# Altium schematic sheet DSO_ADC.SchDoc: Schematic_Name
size A4; CompanyName: University of Melbourne; Engineer: Yijie Tao; DocumentNumber: 1; Revision: 0.1; SheetNumber: 1; SheetTotal: 1; Title_Project: DSO; StudentNo: Student No. 755391
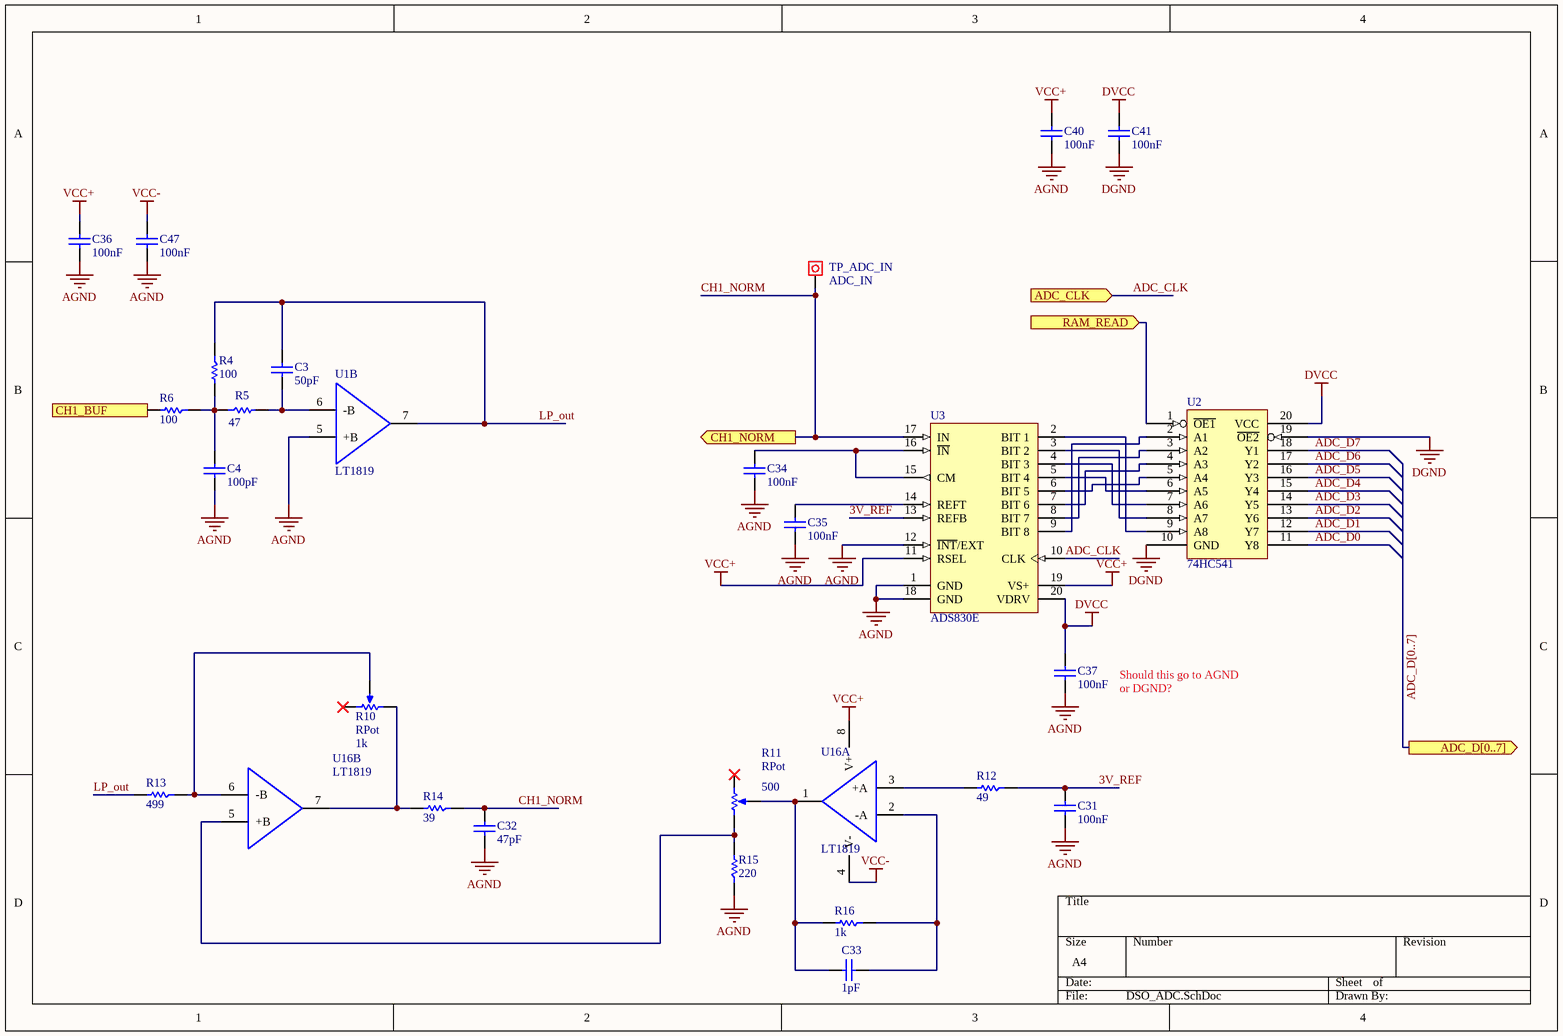
[diagram p0: DSO_ADC.SchDoc]

## Parts
C3  50pF  [0805C]
C4  100pF  [0805C]
C31  100nF  [0805C]
C32  47pF  [0805C]
C33  1pF  [0805C]
C34  100nF  [0805C]
C35  100nF  [0805C]
C36  100nF  [0805C]
C37  100nF  [0805C]
C40  100nF  [0805C]
C41  100nF  [0805C]
C47  100nF  [0805C]
R4  100  [0805]
R5  47  [0805]
R6  100  [0805]
R10  RPot  value 1k  [VR5]
R11  RPot  value 500  [VR5]
R12  49  [0805]
R13  499  [0805]
R14  39  [0805]
R15  220  [0805]
R16  1k  [0805]
TP_ADC_IN  value ADC_IN  [Testpoin]  (hidden comment: INPUT)
U1  LT1819  [SOIC-8]  (part B of 2)
U2  74HC541  [SOT163-1_N]
U3  ADS830E  [TI-DBQ20_L]
U16  LT1819  [SOIC-8]  (parts A,B of 2)

## Ports
ADC_CLK (in), ADC_D[0..7] (out), CH1_BUF (in), CH1_NORM (out), RAM_READ (in)

## Nets
AGND: C4.2 C31.2 C32.2 C34.2 C35.2 C36.2 C37.1 C40.2 C47.2 R15.1 U1.5(+B) U3.1(GND) U3.12(~{INT}/EXT) U3.18(GND)
DGND: C41.2 U2.10(GND) U2.19(~{OE2})
DVCC: C37.2 C41.1 U2.20(VCC) U3.20(VDRV)
VCC+: C36.1 C40.1 U3.11(RSEL) U3.19(VS+) U16.8(V+)
VCC-: C47.1 U16.4(V-)
3V_REF: C31.1 R12.1 U3.13(REFB)
ADC_CLK: U3.10(CLK) ; port ADC_CLK
ADC_D0: U2.11(Y8)
ADC_D1: U2.12(Y7)
ADC_D2: U2.13(Y6)
ADC_D3: U2.14(Y5)
ADC_D4: U2.15(Y4)
ADC_D5: U2.16(Y3)
ADC_D6: U2.17(Y2)
ADC_D7: U2.18(Y1)
CH1_BUF: R6.2 ; port CH1_BUF
CH1_NORM: C32.1 R14.1 TP_ADC_IN.1 U3.17(IN) ; port CH1_NORM
LP_out: C3.1 R4.1 R13.2 U1.7(OUTB)
RAM_READ: U2.1(~{OE1}) ; port RAM_READ
NetC3_2: C3.2 R5.2 U1.6(-B)
NetC4_1: C4.1 R4.2 R5.1 R6.1
NetC33_1: C33.1 R16.1 U16.2(-A)
NetC33_2: C33.2 R11.2(TAP) R16.2 U16.1(OUTA)
NetC34_1: C34.1 U3.15(CM) U3.16(~{IN})
NetC35_1: C35.1 U3.14(REFT)
NetR10_1: R10.1(TOP) R14.2 U16.7(OUTB)
NetR10_2: R10.2(TAP) R13.1 U16.6(-B)
NetR11_1: R11.1(TOP) R15.2 U16.5(+B)
NetR12_2: R12.2 U16.3(+A)
NetU2_2: U2.2(A1) U3.9(BIT_8)
NetU2_3: U2.3(A2) U3.8(BIT_7)
NetU2_4: U2.4(A3) U3.7(BIT_6)
NetU2_5: U2.5(A4) U3.6(BIT_5)
NetU2_6: U2.6(A5) U3.5(BIT_4)
NetU2_7: U2.7(A6) U3.4(BIT_3)
NetU2_8: U2.8(A7) U3.3(BIT_2)
NetU2_9: U2.9(A8) U3.2(BIT_1)

Not connected (* = marked no-connect by the designer): R10 3(BOT)*; R11 3(BOT)*

## Buses and harness runs
bus ADC_D[0..7] = port ADC_D[0..7]

## Notes on the sheet
- Should this go to AGND or DGND?

## Library data of the parts
C3 C4 C31-C37 C40 C41 C47 = C: Capacitor; Reviewed by: RM - 2018/08/05; Revision: July-2002: Re-released for DXP Platform.; Supplier 1: *; Supplier Part Number 1: *
  C3: Value: 50pF
  C4: Value: 100pF
  C31 C34-C37 C40 C41 C47: Value: 100nF
  C32: Value: 47pF
  C33: Value: 1pF
R4-R6 R12-R16 = R: Resistor; Reviewed by: RM - 2018/08/05; Supplier 1: *; Suppler Part Number 1: *
  R4 R6: Value: 100
  R5: Value: 47
  R12: Value: 49
  R13: Value: 499
  R14: Value: 39
  R15: Value: 220
  R16: Value: 1k
R10 R11 = RPot: Potentiometer; Sim Note: Enter the Resistance value and the set point into parameter fields.; Set Position: 0.5; Published: 8-Jun-2000; LatestRevisionDate: 17-Jul-2002; LatestRevisionNote: Re-released for DXP Platform.; PackageReference: VR5; Publisher: Altium Limited; PackageDescription: Variable Resistor, Thru-Hole; 3 Leads
TP_ADC_IN = Test Point: Pad
U1 U16 = LT1819: OpAmp High Frequency Dual; Reviewed by: RM - 2018/08/05; Supplier 1: Digi-Key; Supplier Part Number 1: LT1819CMS8#PBF-ND
U2 = 74HC541: (ADV) Octal Buffer, Line Driver; Reviewed by: RM - 2018/08/05; Supplier 1: Digi-Key; Supplier Part Number 1: 296-1202-1-ND
U3 = ADS830E: 8-Bit, 60 MSPS ADC Single-Ended / Differential Input, Internal / External Reference and Programmble Input Range, -40 to 85 degC, 20-pin SOP (DBQ20), Green (RoHS & no Sb/Br); Reviewed by: RM - 2018/08/05; ComponentLink2URL: http://www.ti.com/general/docs/lit/getliterature.tsp?genericPartNumber=ADS830&fileType=pdf; ComponentLink2Description: Datasheet; ComponentLink1URL: http://www.ti.com/; ComponentLink3URL: http://www.ti.com/litv/pdf/mpds210a; ComponentLink3Description: Package Specification; ComponentLink1Description: Manufacturer URL; Supplier 1: Digi-Key; Supplier Part Number 1: ADS830E-ND